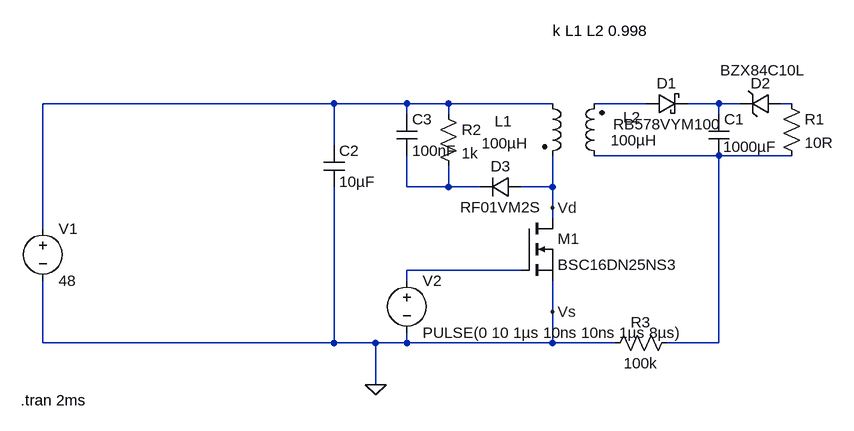
[diagram p0: schematic Soa-Test-1.asc]
Soa-Test-1.asc, the LTspice schematic file:
Version 4
SHEET 1 880 680
WIRE -96 0 -544 0
WIRE 16 0 -96 0
WIRE 80 0 16 0
WIRE 240 0 80 0
WIRE 384 0 304 0
WIRE 496 0 448 0
WIRE 528 0 496 0
WIRE 608 0 592 0
WIRE 16 16 16 0
WIRE 80 16 80 0
WIRE 496 16 496 0
WIRE -96 64 -96 0
WIRE 496 80 304 80
WIRE 608 80 496 80
WIRE 16 128 16 80
WIRE 80 128 80 96
WIRE 80 128 16 128
WIRE 128 128 80 128
WIRE 240 128 240 80
WIRE 240 128 192 128
WIRE 240 160 240 128
WIRE 240 176 240 160
WIRE -544 192 -544 0
WIRE 192 256 16 256
WIRE 16 272 16 256
WIRE 240 320 240 272
WIRE -544 368 -544 272
WIRE -96 368 -96 128
WIRE -96 368 -544 368
WIRE -32 368 -96 368
WIRE 16 368 16 352
WIRE 16 368 -32 368
WIRE 240 368 240 320
WIRE 240 368 16 368
WIRE 336 368 240 368
WIRE 496 368 496 80
WIRE 496 368 416 368
WIRE -32 432 -32 368
FLAG -32 432 0
FLAG 240 160 Vd
FLAG 240 320 Vs
SYMBOL nmos 192 176 R0
SYMATTR InstName M1
SYMATTR Value BSC16DN25NS3
SYMBOL ind2 224 -16 R0
WINDOW 0 -73 43 Left 2
WINDOW 3 -93 77 Left 2
SYMATTR InstName L1
SYMATTR Value 100µH
SYMATTR Type ind
SYMBOL ind2 320 96 R180
WINDOW 0 -56 75 Left 2
WINDOW 3 -81 40 Left 2
SYMATTR InstName L2
SYMATTR Value 100µH
SYMATTR Type ind
SYMBOL schottky 384 16 R270
WINDOW 0 32 32 VTop 2
WINDOW 3 0 32 VBottom 2
SYMATTR InstName D1
SYMATTR Value RB578VYM100
SYMATTR Description Diode
SYMATTR Type diode
SYMBOL cap 480 16 R0
WINDOW 3 23 50 Left 2
SYMATTR InstName C1
SYMATTR Value 1000µF
SYMBOL cap -112 64 R0
SYMATTR InstName C2
SYMATTR Value 10µF
SYMATTR SpiceLine Rser=10m Lser=10nH
SYMBOL voltage -544 176 R0
WINDOW 123 0 0 Left 0
WINDOW 39 0 0 Left 0
SYMATTR InstName V1
SYMATTR Value 48
SYMBOL res 592 -16 R0
SYMATTR InstName R1
SYMATTR Value 10R
SYMBOL zener 592 -16 R90
WINDOW 0 0 32 VBottom 2
WINDOW 3 -51 28 VTop 2
SYMATTR InstName D2
SYMATTR Value BZX84C10L
SYMATTR Description Diode
SYMATTR Type diode
SYMBOL voltage 16 256 R0
WINDOW 123 0 0 Left 0
WINDOW 39 0 0 Left 0
SYMATTR InstName V2
SYMATTR Value PULSE(0 10 1µs 10ns 10ns 1µs 8µs)
SYMBOL diode 192 112 R90
WINDOW 0 0 32 VBottom 2
WINDOW 3 32 32 VTop 2
SYMATTR InstName D3
SYMATTR Value RF01VM2S
SYMBOL cap 0 16 R0
SYMATTR InstName C3
SYMATTR Value 100nF
SYMBOL res 64 0 R0
SYMATTR InstName R2
SYMATTR Value 1k
SYMBOL res 432 352 R90
WINDOW 0 0 56 VBottom 2
WINDOW 3 32 56 VTop 2
SYMATTR InstName R3
SYMATTR Value 100k
TEXT 240 -112 Left 2 !k L1 L2 0.998
TEXT -578 456 Left 2 !.tran 2ms

The netlist it stands for:
* Soa-Test-1.asc
M1 Vd N007 0 0 BSC16DN25NS3
L1 N001 Vd 100µH
L2 N005 N002 100µH
D1 N002 N003 RB578VYM100
C1 N003 N005 1000µF
C2 N001 0 10µF Rser=10m Lser=10nH
V1 N001 0 48
R1 N004 N005 10R
D2 N004 N003 BZX84C10L
V2 N007 0 PULSE(0 10 1µs 10ns 10ns 1µs 8µs)
D3 Vd N006 RF01VM2S
C3 N001 N006 100nF
R2 N001 N006 1k
R3 N005 0 100k
.model D D
.lib standard.dio
.model NMOS NMOS
.model PMOS PMOS
.lib standard.mos
k L1 L2 0.998
.tran 2ms
.backanno
.end